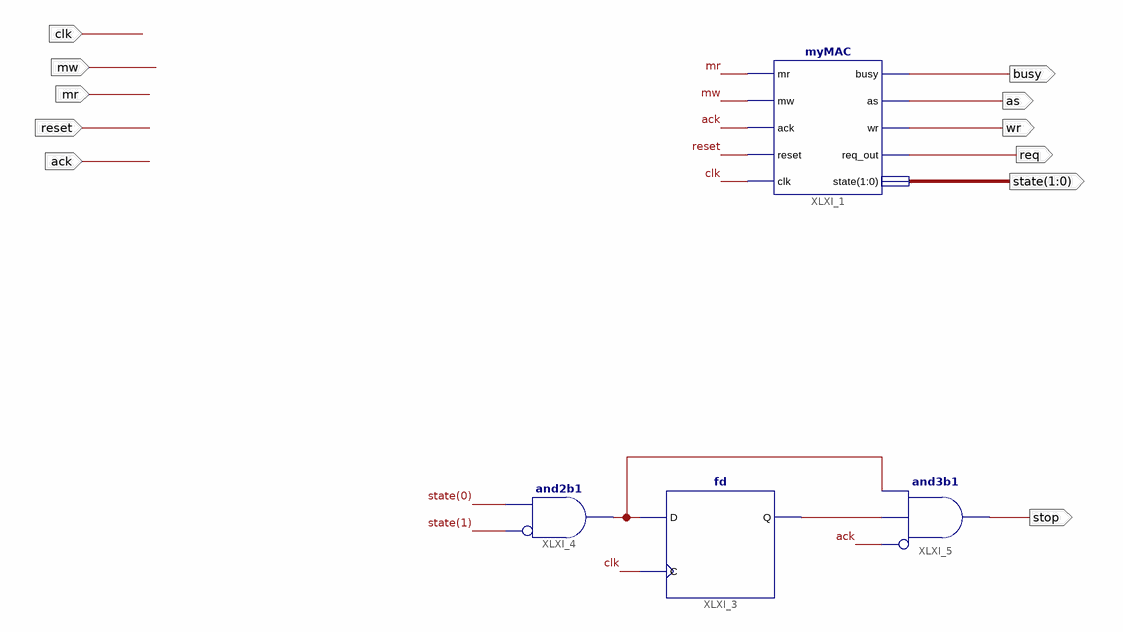
[diagram p0: schematic sheet 1]
// Xilinx ISE schematic myMACschematic.sch (spartan2) as structural Verilog: 4 symbols, 11 ports
module myMACschematic (
  input  clk,
  input  reset,
  input  ack,
  input  mw,
  input  mr,
  output stop,
  output req,
  output as,
  output wr,
  output busy,
  output [1:0] state
);

  wire XLXN_39, XLXN_40;

  fd XLXI_3 (.C(clk), .D(XLXN_40), .Q(XLXN_39));
  and XLXI_4 (XLXN_40, ~state[1], state[0]);  // and2b1
  and XLXI_5 (stop, ~ack, XLXN_39, XLXN_40);  // and3b1
  myMAC XLXI_1 (
    .mr(mr), .mw(mw), .ack(ack), .reset(reset), .clk(clk), .busy(busy), .as(as), .wr(wr), .req_out(req),
    .state(state));
endmodule
